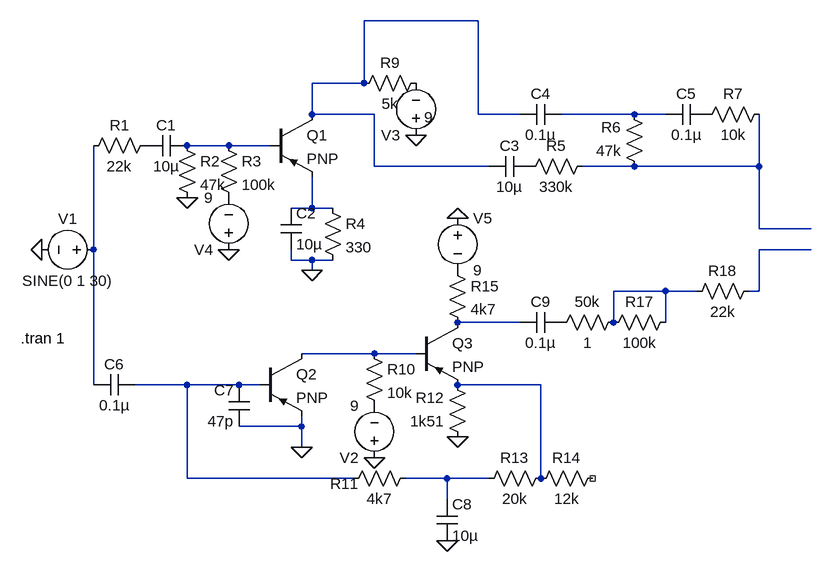
[diagram p0: schematic goyapanther.asc]
goyapanther.asc, the LTspice schematic file:
Version 4
SHEET 1 1172 680
WIRE 656 -176 480 -176
WIRE 480 -80 480 -176
WIRE 480 -80 400 -80
WIRE 400 -32 400 -80
WIRE 496 -32 400 -32
WIRE 656 -32 656 -176
WIRE 720 -32 656 -32
WIRE 896 -32 784 -32
WIRE 944 -32 896 -32
WIRE 272 16 208 16
WIRE 336 16 272 16
WIRE 496 48 496 -32
WIRE 672 48 496 48
WIRE 896 48 816 48
WIRE 1088 48 1088 -32
WIRE 1088 48 896 48
WIRE 400 112 400 64
WIRE 400 112 368 112
WIRE 432 112 400 112
WIRE 1088 144 1088 48
WIRE 1168 144 1088 144
WIRE 64 176 64 16
WIRE 1168 176 1088 176
WIRE 368 192 368 176
WIRE 400 192 368 192
WIRE 432 192 400 192
WIRE 400 208 400 192
WIRE 944 240 864 240
WIRE 992 240 944 240
WIRE 1088 240 1088 176
WIRE 1088 240 1072 240
WIRE 720 288 624 288
WIRE 864 288 864 240
WIRE 944 288 944 240
WIRE 496 336 384 336
WIRE 560 336 496 336
WIRE 64 384 64 176
WIRE 208 384 128 384
WIRE 288 384 208 384
WIRE 320 384 288 384
WIRE 752 384 624 384
WIRE 384 448 384 432
WIRE 384 448 288 448
WIRE 384 480 384 448
WIRE 208 528 208 384
WIRE 464 528 208 528
WIRE 608 528 544 528
WIRE 672 528 608 528
WIRE 752 528 752 384
WIRE 608 560 608 528
FLAG 208 96 0
FLAG 400 208 0
FLAG 624 464 0
FLAG 384 480 0
FLAG -16 176 0
FLAG 496 496 0
FLAG 560 0 0
FLAG 272 176 0
FLAG 624 128 0
FLAG 608 624 0
SYMBOL res 160 0 R90
WINDOW 0 0 56 VBottom 2
WINDOW 3 32 56 VTop 2
SYMATTR InstName R1
SYMATTR Value 22k
SYMBOL cap 208 0 R90
WINDOW 0 0 32 VBottom 2
WINDOW 3 32 32 VTop 2
SYMATTR InstName C1
SYMATTR Value 10µ
SYMBOL res 192 0 R0
SYMATTR InstName R2
SYMATTR Value 47k
SYMBOL res 256 0 R0
SYMATTR InstName R3
SYMATTR Value 100k
SYMBOL pnp 336 -32 R0
SYMATTR InstName Q1
SYMBOL cap 352 112 R0
SYMATTR InstName C2
SYMATTR Value 10µ
SYMBOL res 416 96 R0
SYMATTR InstName R4
SYMATTR Value 330
SYMBOL cap 736 32 R90
WINDOW 0 0 32 VBottom 2
WINDOW 3 32 32 VTop 2
SYMATTR InstName C3
SYMATTR Value 10µ
SYMBOL res 832 32 R90
WINDOW 0 0 56 VBottom 2
WINDOW 3 32 56 VTop 2
SYMATTR InstName R5
SYMATTR Value 330k
SYMBOL res 912 64 R180
WINDOW 0 36 76 Left 2
WINDOW 3 36 40 Left 2
SYMATTR InstName R6
SYMATTR Value 47k
SYMBOL cap 784 -48 R90
WINDOW 0 0 32 VBottom 2
WINDOW 3 32 32 VTop 2
SYMATTR InstName C4
SYMATTR Value 0.1µ
SYMBOL cap 1008 -48 R90
WINDOW 0 0 32 VBottom 2
WINDOW 3 32 32 VTop 2
SYMATTR InstName C5
SYMATTR Value 0.1µ
SYMBOL res 1104 -48 R90
WINDOW 0 0 56 VBottom 2
WINDOW 3 32 56 VTop 2
SYMATTR InstName R7
SYMATTR Value 10k
SYMBOL res 576 -96 R90
WINDOW 0 0 56 VBottom 2
WINDOW 3 32 56 VTop 2
SYMATTR InstName R9
SYMATTR Value 5k
SYMBOL cap 128 368 R90
WINDOW 0 0 32 VBottom 2
WINDOW 3 32 32 VTop 2
SYMATTR InstName C6
SYMATTR Value 0.1µ
SYMBOL cap 304 448 R180
WINDOW 0 24 56 Left 2
WINDOW 3 24 8 Left 2
SYMATTR InstName C7
SYMATTR Value 47p
SYMBOL pnp 320 336 R0
SYMATTR InstName Q2
SYMBOL pnp 560 288 R0
SYMATTR InstName Q3
SYMBOL res 480 320 R0
SYMATTR InstName R10
SYMATTR Value 10k
SYMBOL res 560 512 R90
WINDOW 0 40 110 VBottom 2
WINDOW 3 32 56 VTop 2
SYMATTR InstName R11
SYMATTR Value 4k7
SYMBOL res 640 480 R180
WINDOW 0 36 76 Left 2
WINDOW 3 36 40 Left 2
SYMATTR InstName R12
SYMATTR Value 1k51
SYMBOL res 656 544 R270
WINDOW 0 32 56 VTop 2
WINDOW 3 0 56 VBottom 2
SYMATTR InstName R13
SYMATTR Value 20k
SYMBOL res 736 544 R270
WINDOW 0 32 56 VTop 2
WINDOW 3 0 56 VBottom 2
SYMATTR InstName R14
SYMATTR Value 12k
SYMBOL cap 592 560 R0
SYMATTR InstName C8
SYMATTR Value 10µ
SYMBOL voltage 80 176 R90
WINDOW 0 -32 56 VBottom 2
WINDOW 3 32 56 VTop 2
WINDOW 123 0 0 Left 0
WINDOW 39 0 0 Left 0
SYMATTR InstName V1
SYMATTR Value SINE(0 1 30)
SYMBOL res 608 192 R0
SYMATTR InstName R15
SYMATTR Value 4k7
SYMBOL cap 784 272 R90
WINDOW 0 0 32 VBottom 2
WINDOW 3 32 32 VTop 2
SYMATTR InstName C9
SYMATTR Value 0.1µ
SYMBOL res 880 272 R90
WINDOW 0 0 56 VBottom 2
WINDOW 3 32 56 VTop 2
SYMATTR InstName 50k
SYMATTR Value 1
SYMBOL res 960 272 R90
WINDOW 0 0 56 VBottom 2
WINDOW 3 32 56 VTop 2
SYMATTR InstName R17
SYMATTR Value 100k
SYMBOL res 1088 224 R90
WINDOW 0 0 56 VBottom 2
WINDOW 3 32 56 VTop 2
SYMATTR InstName R18
SYMATTR Value 22k
SYMBOL voltage 496 512 R180
WINDOW 123 0 0 Left 0
WINDOW 39 0 0 Left 0
SYMATTR InstName V2
SYMATTR Value 9
SYMBOL voltage 560 16 R180
WINDOW 3 -26 44 Left 2
WINDOW 123 0 0 Left 0
WINDOW 39 0 0 Left 0
SYMATTR Value 9
SYMATTR InstName V3
SYMBOL voltage 272 192 R180
WINDOW 123 0 0 Left 0
WINDOW 39 0 0 Left 0
SYMATTR InstName V4
SYMATTR Value 9
SYMBOL voltage 624 112 R0
WINDOW 123 0 0 Left 0
WINDOW 39 0 0 Left 0
SYMATTR InstName V5
SYMATTR Value 9
TEXT -48 312 Left 2 !.tran 1

The netlist it stands for:
* goyapanther.asc
R1 P001 N006 22k
C1 N003 P001 10µ
R2 N003 0 47k
R3 N003 P002 100k
Q1 N001 N003 N005 0 PNP
C2 N005 0 10µ
R4 N005 0 330
C3 P003 N001 10µ
R5 N004 P003 330k
R6 N004 N002 47k
C4 N002 N001 0.1µ
C5 P004 N002 0.1µ
R7 N004 P004 10k
R9 P005 N001 5k
C6 N011 N006 0.1µ
C7 0 N011 47p
Q2 N010 N011 0 0 PNP
Q3 N009 N010 N012 0 PNP
R10 N010 P006 10k
R11 N013 N011 4k7
R12 0 N012 1k51
R13 N013 N012 20k
R14 N012 NC_01 12k
C8 N013 0 10µ
V1 N006 0 SINE(0 1 30)
R15 P007 N009 4k7
C9 P008 N009 0.1µ
R§50k N008 P008 1
R17 N008 N008 100k
R18 N007 N008 22k
V2 0 P006 9
V3 0 P005 9
V4 0 P002 9
V5 0 P007 9
.model NPN NPN
.model PNP PNP
.lib standard.bjt
.tran 1
.backanno
.end